# EasyEDA schematic SCH_Magnetar.json
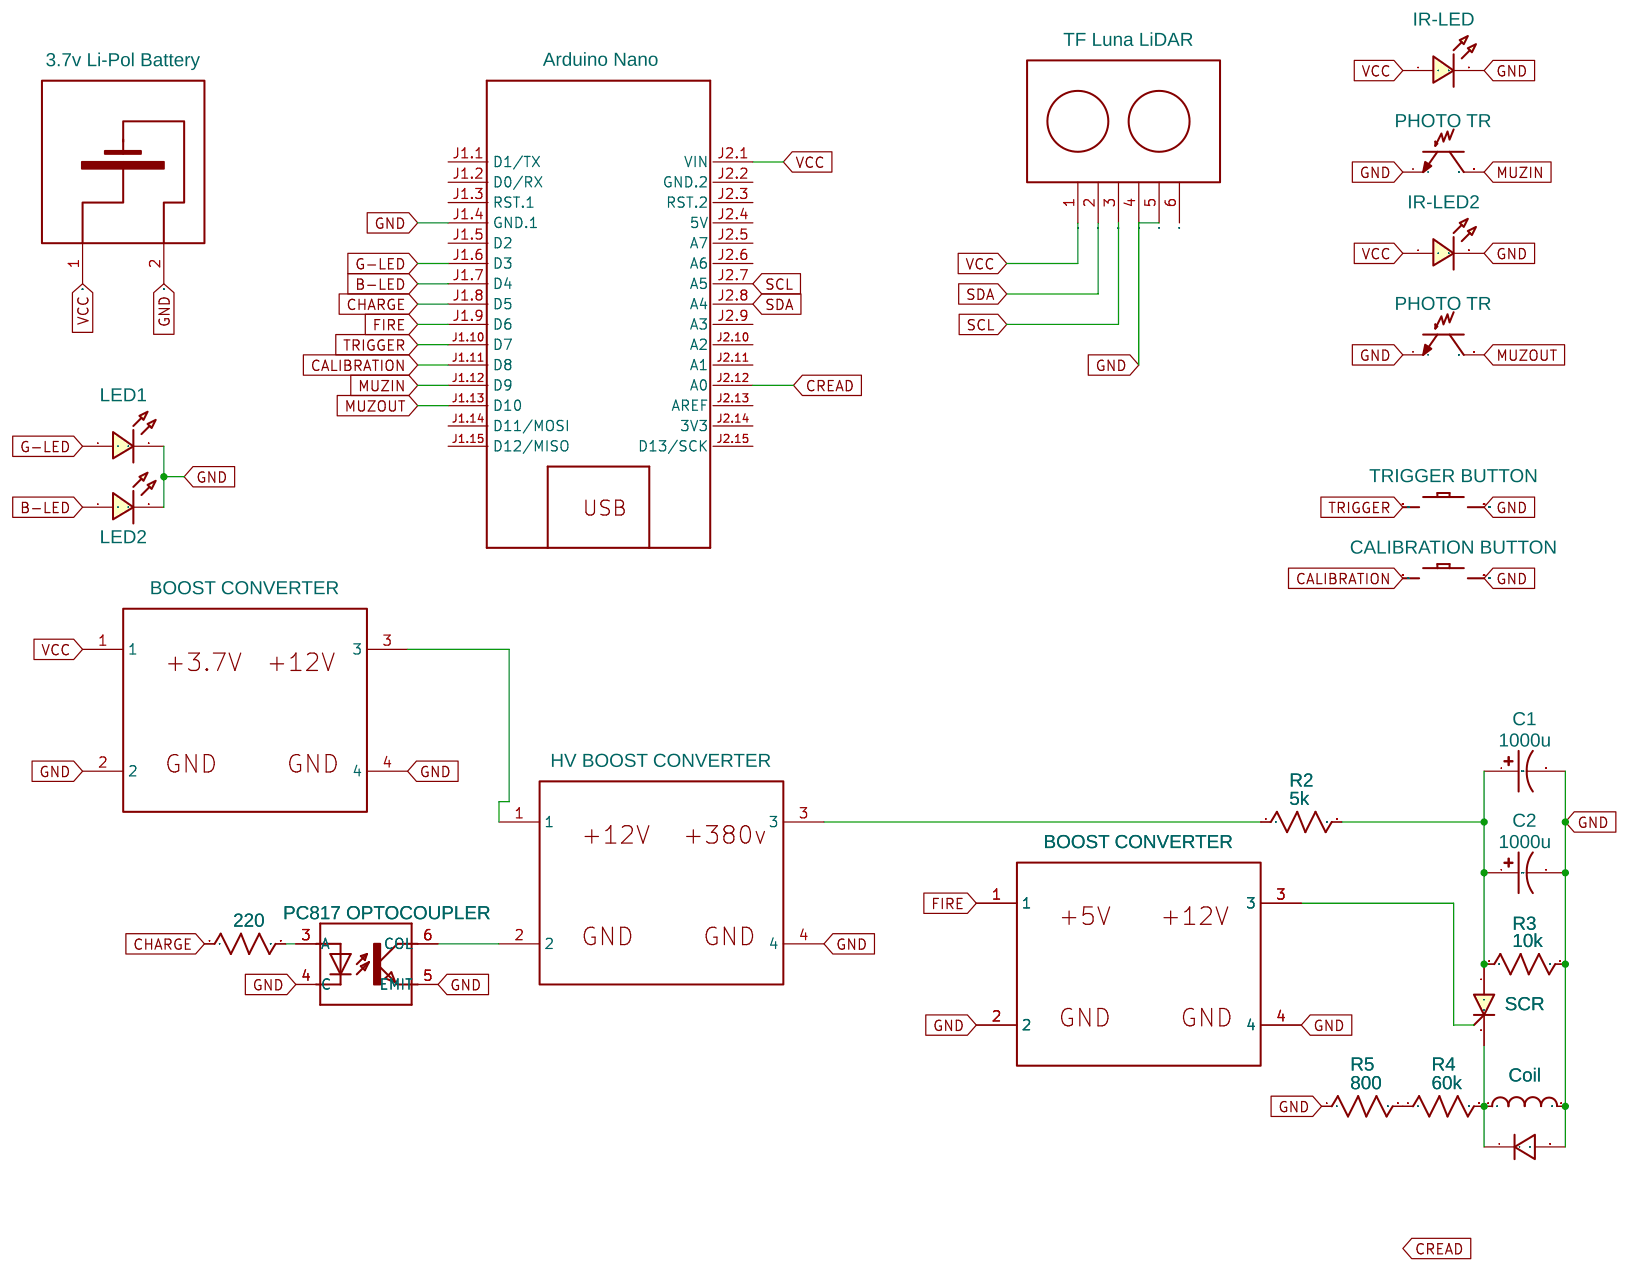
[diagram p0: schematic sheet]

## Parts
1  TRIGGER BUTTON  [32TEETH---CONDUCTIVE-BUTTONS_CONDUCTIVE_BUTTON_DIRECTIONAL_THICK]
6  CALIBRATION BUTTON  [32TEETH---CONDUCTIVE-BUTTONS_CONDUCTIVE_BUTTON_DIRECTIONAL_THICK]
C1  1000u  [CASE-A_3216]
C2  1000u  [CASE-A_3216]
D1  1N4007W  [SOD-123_L2.8-W1.8-LS3.7-RD]
FQ1  PHOTO TR  [PHOTOTRANSISTOR-5MM/2.54]
FQ2  PHOTO TR  [PHOTOTRANSISTOR-5MM/2.54]
L1  Coil  [L-SMD-6.0X6.0X4.5]
LED1  LED-0603_G  [LED0603_GREEN]
LED2  LED-0603_R  [LED0603_RED]
LED3  IR-LED  [LED0603_RED]
LED4  IR-LED2  [LED-TH_BD3.0_RED]
M1  Arduino Nano  [ARDUINO-NANO-3.0]
OK1  PC817 OPTOCOUPLER  [OPTOCOUPLER-2-SOIC08]  (section 1)
R1  220  [R0603]
R2  5k  [R0603]
R3  10k  [R0603]
R4  60k  [R0603]
R5  800  [R0603]
T1  SCR  [THYRISTOR]
U1  3.7v Li-Pol Battery  [LI-POL-BATTERY-4X30X40]
U2  HV BOOST CONVERTER  [BOOST CONVERTER]
U3  BOOST CONVERTER  [BOOST CONVERTER]
U4  BOOST CONVERTER  [BOOST CONVERTER]
U5  TF Luna LiDAR  [TF LUNA LIDAR]

## Library data of the parts
1 6 = button: Contributor: JC Elayron
C1 C2 = C_Tan_SMD_A_US: Contributor: LCEDA_Lib
D1 = 1N4007W: Supplier: LCSC; Supplier Part: C328592; Manufacturer: BLUE ROCKET; Contributor: LCEDA_Lib
FQ1 FQ2 = PHOTO TR: Manufacturer Part: QSD123; Contributor: Junikos; Supplier Part: C184518; Supplier: LCSC; link: https://datasheet.lcsc.com/szlcsc/ON-Semicon-ON-QSD123_C184518.pdf
L1 = coil: Supplier: LCSC; Supplier Part: C257241; Manufacturer: Coilmaster Elec; Manufacturer Part: SQH6020S-2R2M-LF; Contributor: LCSC
LED1 = LED-0603_G: Manufacturer: EVERLIGHT(台湾亿光); Manufacturer Part: 19-217/GHC-YR1S2/3T; Supplier Part: C72043; Supplier: LCSC; Contributor: LCEDA_Lib
LED2 LED3 = LED-0603_R: Manufacturer: EVERLIGHT(台湾亿光); Manufacturer Part: 19-217/R6C-AL1M2VY/3T; Supplier Part: C72044; Supplier: LCSC; Contributor: LCEDA_01
LED4 = LED-TH-3mm_R: Manufacturer: EVERLIGHT(台湾亿光); Manufacturer Part: 204-10SDRD/S530-A3-L; Supplier Part: C84774; Supplier: LCSC; Contributor: LCEDA_Lib
M1 = ARDUINO-NANO-3.0: Contributor: Neeraj Aggarwal
OK1 = ILD205: Contributor: Whatsup12345; subpart_no: 1
R1-R5 = R_0603_US: Contributor: LCEDA_Lib
T1 = THYRISTOR: Contributor: KiCad
U1 = Li-Pol Battery 4x30x40: Manufacturer Part: 540-563; Contributor: vaclavm; Supplier Part: 540-563; Supplier: GME; link: https://www.gme.cz/li-pol-akumulator-3-7v-400mah-4x30x35mm
U2-U4 = Boost Converter: Contributor: Huy Quang
U5 = TF Luna LiDAR: Supplier: Benewake; Contributor: michalmaniak2000

## Nets
GND: 1.P$ACTIVE 6.P$ACTIVE C1.2 C2.2 D1.2 FQ1.E FQ2.E L1.2 LED1.2 LED2.2 LED3.2 LED4.2 M1.J1.4(GND.1) OK1.4(C) OK1.5(EMIT) R3.2 R5.1 U2.4 U3.2 U3.4 U4.2 U4.4
VCC: LED3.1 LED4.1 M1.J2.1(VIN) U3.1
B-LED: LED2.1 M1.J1.7(D4)
CALIBRATION: 6.P$GND M1.J1.11(D8)
CHARGE: M1.J1.8(D5) R1.1
CREAD: M1.J2.12(A0)
FIRE: M1.J1.9(D6) U4.1
G-LED: LED1.1 M1.J1.6(D3)
MUZIN: FQ2.C M1.J1.12(D9)
MUZOUT: FQ1.C M1.J1.13(D10)
SCL: M1.J2.7(A5)
SDA: M1.J2.8(A4)
TRIGGER: 1.P$GND M1.J1.10(D7)
Net-(C1-1): C1.1 C2.1 R2.2 R3.1 T1.A
Net-(D1-1): D1.1 L1.1 R4.2 T1.K
Net-(OK1.1-3): OK1.3(A) R1.2
Net-(OK1.1-6): OK1.6(COL) U2.2
Net-(R2-1): R2.1 U2.3
Net-(R4-1): R4.1 R5.2
Net-(U2-1): U2.1 U3.3

Not connected (* = marked no-connect by the designer): M1 J1.1(D1/TX) J1.2(D0/RX) J1.3(RST.1) J1.5(D2) J1.14(D11/MOSI) J1.15(D12/MISO) J2.2(GND.2) J2.3(RST.2) J2.4(5V) J2.5(A7) J2.6(A6) J2.9(A3) J2.10(A2) J2.11(A1) J2.13(AREF) J2.14(3V3) J2.15(D13/SCK); U1 1(BAT+) 2(BAT-); U4 3; U5 1(VCC) 2(SDA) 3(SCL) 4(GND) 5(/1) 6(/2)
